# EAGLE schematic vocore_badge (EAGLE 7.2.0)

## Sheet 1 of 2
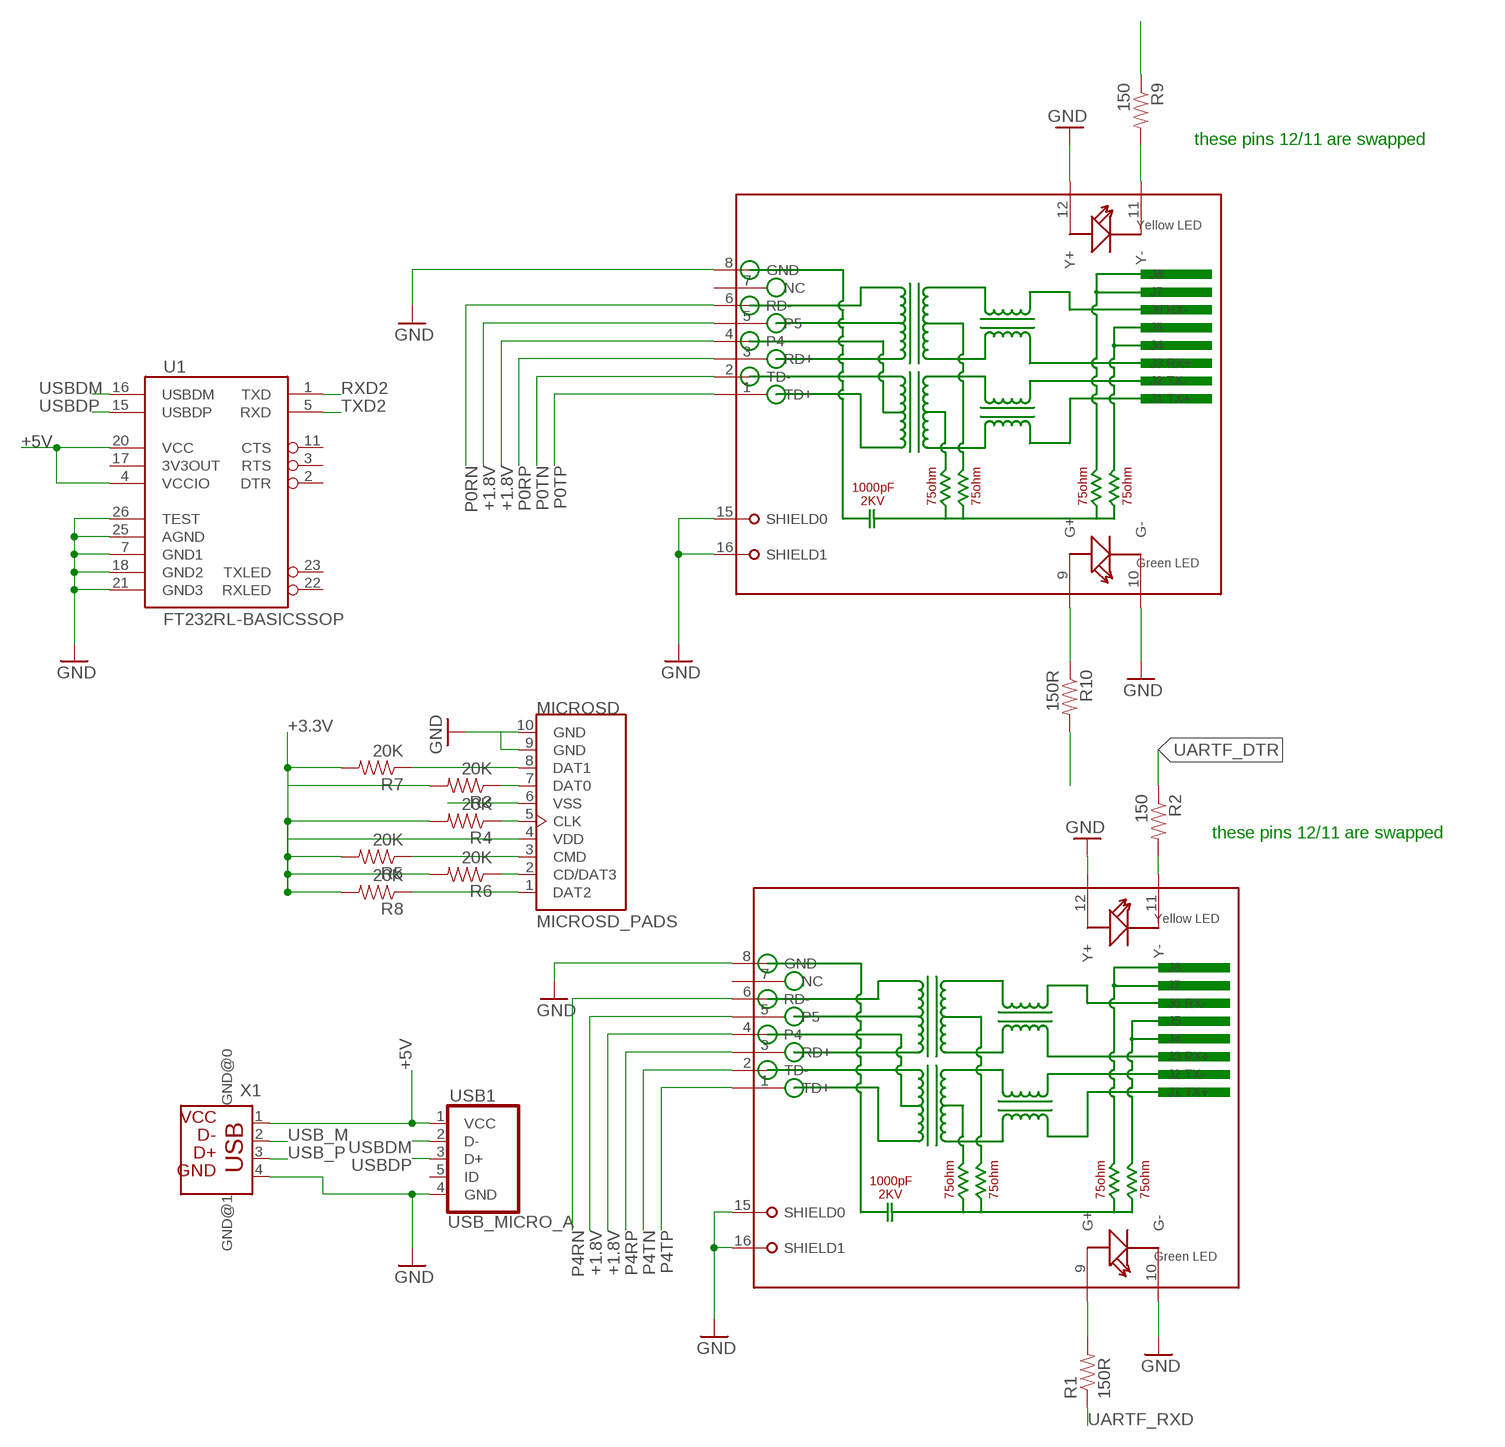
[diagram p0: schematic, sheet 1]

### Parts
MICROSD  MICROSD_PADS  [MICROSD_PADS_1PRIMARY]
R1  150R  RESISTOR0805-RES  [0805]
R2  150  RESISTOR0805-RES  [0805]
R3  20K  RESISTOR0805-RES  [0805]
R4  20K  RESISTOR0805-RES  [0805]
R5  20K  RESISTOR0805-RES  [0805]
R6  20K  RESISTOR0805-RES  [0805]
R7  20K  RESISTOR0805-RES  [0805]
R8  20K  RESISTOR0805-RES  [0805]
R9  150  RESISTOR0805-RES  [0805]
R10  150R  RESISTOR0805-RES  [0805]
RJ1  RJ45ALED  HR911105AHR911105A  [RJ45ALED_1PRIMARY]
RJ45  RJ45ALED  HR911105AHR911105A  [RJ45ALED_1PRIMARY]
U1  FT232RL-BASICSSOP  [SSOP28DB]
USB1  USB_MICRO_A  USB_MICRO_AUSB_MICRO_A  [USB_MICRO_A_1PRIMARY]
X1  USB-787616  [USB]

### Nets
+1.8V: RJ1.4 RJ1.5 RJ45.4 RJ45.5 ; also sheet 2
+3.3V: MICROSD.4(VDD) R3.2 R4.2 R5.2 R6.2 R7.2 R8.2 ; also sheet 2
+5V: U1.4(VCCIO) U1.20(VCC) USB1.1(VCC) X1.1 ; also sheet 2
GND: MICROSD.6(VSS) MICROSD.9(GND) MICROSD.10(GND) RJ1.8(GND) RJ1.10(G-) RJ1.12(Y+) RJ1.15(SHIELD0) RJ1.16(SHIELD1) RJ45.8(GND) RJ45.10(G-) RJ45.12(Y+) RJ45.15(SHIELD0) RJ45.16(SHIELD1) U1.7(GND1) U1.18(GND2) U1.21(GND3) U1.25(AGND) U1.26(TEST) USB1.4(GND) X1.4 ; also sheet 2
LED2: R10.2 ; also sheet 2
LED3: R9.1 ; also sheet 2
LED_G: R1.2 RJ45.9(G+)
LED_Y: R2.2 RJ45.11(Y-)
N$1: R9.2 RJ1.11(Y-)
N$4: R10.1 RJ1.9(G+)
P0RN: RJ1.6(RD-) ; also sheet 2
P0RP: RJ1.3(RD+) ; also sheet 2
P0TN: RJ1.2(TD-) ; also sheet 2
P0TP: RJ1.1(TD+) ; also sheet 2
P4RN: RJ45.6(RD-) ; also sheet 2
P4RP: RJ45.3(RD+) ; also sheet 2
P4TN: RJ45.2(TD-) ; also sheet 2
P4TP: RJ45.1(TD+) ; also sheet 2
RXD2: U1.1(TXD) ; also sheet 2
SPI_CLK: MICROSD.5(CLK) R4.1 ; also sheet 2
SPI_CS1: MICROSD.2(CD/DAT3) R6.1 ; also sheet 2
SPI_MISO: MICROSD.7(DAT0) R3.1 ; also sheet 2
SPI_MOSI: MICROSD.3(CMD) R5.1 ; also sheet 2
SPI_RSV1: MICROSD.8(DAT1) R7.1
SPI_RSV2: MICROSD.1(DAT2) R8.1
TXD2: U1.5(RXD) ; also sheet 2
UARTF_DTR: R2.1 ; also sheet 2
UARTF_RXD: R1.1 ; also sheet 2
USB_M: X1.2 ; also sheet 2
USB_P: X1.3 ; also sheet 2
USBDM: U1.16(USBDM) USB1.2(D-)
USBDP: U1.15(USBDP) USB1.3(D+)
Unconnected: RJ1.7(NC) RJ45.7(NC) U1.2(DTR) U1.3(RTS) U1.11(CTS) U1.17(3V3OUT) U1.22(RXLED) U1.23(TXLED) USB1.5(ID)

### Notes on the sheet
- these pins 12/11 are swapped
- these pins 12/11 are swapped

## Sheet 2 of 2
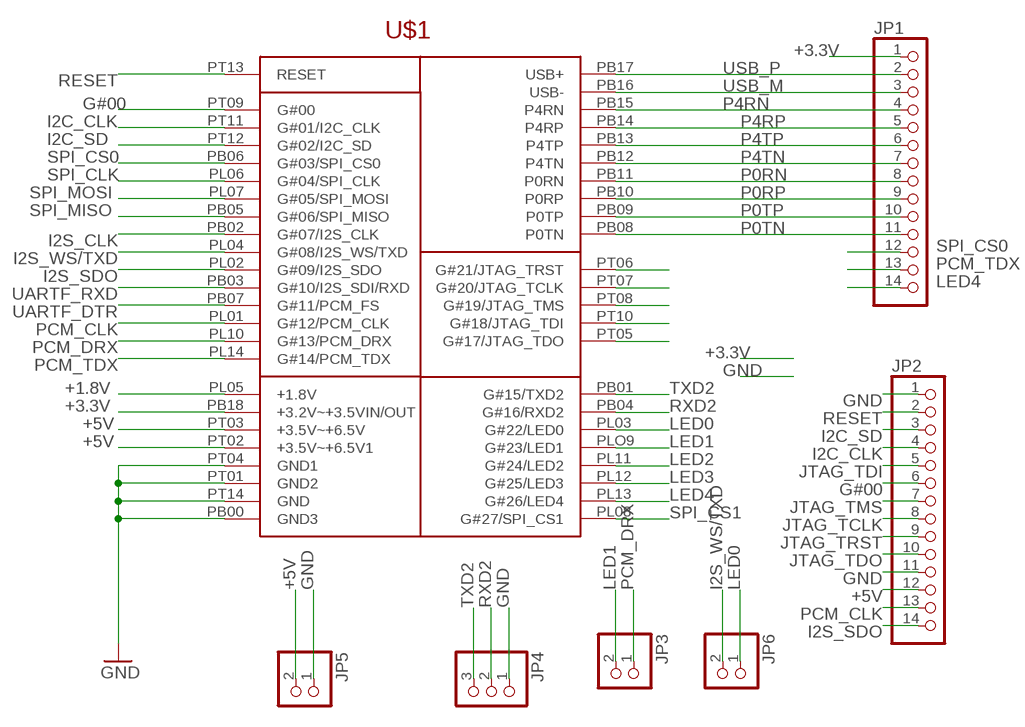
[diagram p1: schematic, sheet 2]

### Parts
JP1  PINHD-1X14  [1X14]
JP2  PINHD-1X14  [1X14]
JP3  PINHD-1X2  [1X02]
JP4  PINHD-1X3  [1X03]
JP5  PINHD-1X2  [1X02]
JP6  PINHD-1X2  [1X02]
U$1  VOCORE_SHIELD  [VOCORE_DOC_CUSTOM]

### Nets
+1.8V: U$1.PL05(+1.8V) ; also sheet 1
+3.3V: JP1.1 U$1.PB18(+3.2V~+3.5VIN/OUT) ; also sheet 1
+5V: JP2.12 JP5.2 U$1.PT02(+3.5V~+6.5V1) U$1.PT03(+3.5V~+6.5V) ; also sheet 1
G#00: JP2.6 U$1.PT09(G#00)
GND: JP2.1 JP2.11 JP4.1 JP5.1 U$1.PB00(GND3) U$1.PT01(GND2) U$1.PT04(GND1) U$1.PT14(GND) ; also sheet 1
I2C_CLK: JP2.4 U$1.PT11(G#01/I2C_CLK)
I2C_SD: JP2.3 U$1.PT12(G#02/I2C_SD)
I2S_CLK: U$1.PB02(G#07/I2S_CLK)
I2S_SDO: JP2.14 U$1.PL02(G#09/I2S_SDO)
I2S_WS/TXD: JP6.2 U$1.PL04(G#08/I2S_WS/TXD)
JTAG_TCLK: JP2.8 U$1.PT07(G#20/JTAG_TCLK)
JTAG_TDI: JP2.5 U$1.PT10(G#18/JTAG_TDI)
JTAG_TDO: JP2.10 U$1.PT05(G#17/JTAG_TDO)
JTAG_TMS: JP2.7 U$1.PT08(G#19/JTAG_TMS)
JTAG_TRST: JP2.9 U$1.PT06(G#21/JTAG_TRST)
LED0: JP6.1 U$1.PL03(G#22/LED0)
LED1: JP3.2 U$1.PLO9(G#23/LED1)
LED2: U$1.PL11(G#24/LED2) ; also sheet 1
LED3: U$1.PL12(G#25/LED3) ; also sheet 1
LED4: JP1.14 U$1.PL13(G#26/LED4)
P0RN: JP1.8 U$1.PB11(P0RN) ; also sheet 1
P0RP: JP1.9 U$1.PB10(P0RP) ; also sheet 1
P0TN: JP1.11 U$1.PB08(P0TN) ; also sheet 1
P0TP: JP1.10 U$1.PB09(P0TP) ; also sheet 1
P4RN: JP1.4 U$1.PB15(P4RN) ; also sheet 1
P4RP: JP1.5 U$1.PB14(P4RP) ; also sheet 1
P4TN: JP1.7 U$1.PB12(P4TN) ; also sheet 1
P4TP: JP1.6 U$1.PB13(P4TP) ; also sheet 1
PCM_CLK: JP2.13 U$1.PL01(G#12/PCM_CLK)
PCM_DRX: JP3.1 U$1.PL10(G#13/PCM_DRX)
PCM_TDX: JP1.13 U$1.PL14(G#14/PCM_TDX)
RESET: JP2.2 U$1.PT13(RESET)
RXD2: JP4.2 U$1.PB04(G#16/RXD2) ; also sheet 1
SPI_CLK: U$1.PL06(G#04/SPI_CLK) ; also sheet 1
SPI_CS0: JP1.12 U$1.PB06(G#03/SPI_CS0)
SPI_CS1: U$1.PL08(G#27/SPI_CS1) ; also sheet 1
SPI_MISO: U$1.PB05(G#06/SPI_MISO) ; also sheet 1
SPI_MOSI: U$1.PL07(G#05/SPI_MOSI) ; also sheet 1
TXD2: JP4.3 U$1.PB01(G#15/TXD2) ; also sheet 1
UARTF_DTR: U$1.PB07(G#11/PCM_FS) ; also sheet 1
UARTF_RXD: U$1.PB03(G#10/I2S_SDI/RXD) ; also sheet 1
USB_M: JP1.3 U$1.PB16(USB-) ; also sheet 1
USB_P: JP1.2 U$1.PB17(USB+) ; also sheet 1

## Power pins joined to a net without a drawn wire
5: X1.GND@0
6: X1.GND@1

## Library data of the parts
JP1 JP2 = adafruit:PINHD-1X14: PIN HEADER
JP3 JP5 JP6 = pinhead:PINHD-1X2: PIN HEADER
JP4 = adafruit:PINHD-1X3: PIN HEADER
MICROSD = vocore_dock:MICROSD_PADS
R1-R10 = SparkFun-Resistors:RESISTOR: Resistor Basic schematic elements and footprints for 0603, 1206, and PTH resistors.
RJ1 RJ45 = vocore_dock:HR911105A
U1 = SparkFun:FT232RL-BASIC: USB UART This is the simplified version of the FT232RL unit. Only what you need, nothing you don't. Spark Fun Electronics SKU : COM-00650
U$1 = Vocore:VOCORE_SHIELD
USB1 = vocore_dock:USB_MICRO_A
X1 = con-amp:USB-787616: AMP connector

## Net classes
0 default: width 0.254 mm, clearance 0.152 mm